# Altium schematic sheet 99_MISCS.SchDoc: Miscellaneous
size A; DocumentNumber: 12; SheetNumber: 12; SheetTotal: 12
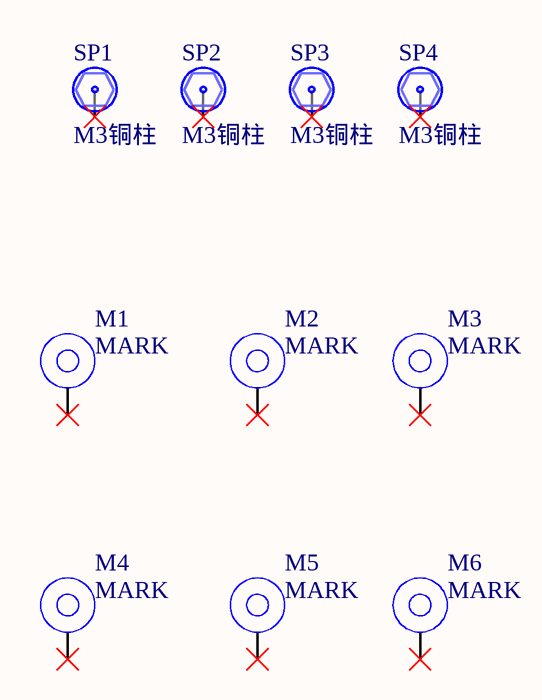
[diagram p0: 99_MISCS.SchDoc]

## Parts
M1  MARK  [MARK]  (net tie, no BOM)
M2  MARK  [MARK]  (net tie, no BOM)
M3  MARK  [MARK]  (net tie, no BOM)
M4  MARK  [MARK]  (net tie, no BOM)
M5  MARK  [MARK]  (net tie, no BOM)
M6  MARK  [MARK]  (net tie, no BOM)
SP1  M3铜柱  [M3x4_N]  (net tie, no BOM)
SP2  M3铜柱  [M3x4_N]  (net tie, no BOM)
SP3  M3铜柱  [M3x4_N]  (net tie, no BOM)
SP4  M3铜柱  [M3x4_N]  (net tie, no BOM)

## Nets

Not connected (* = marked no-connect by the designer): M1 1*; M2 1*; M3 1*; M4 1*; M5 1*; M6 1*; SP1 1*; SP2 1*; SP3 1*; SP4 1*

## Notes on the sheet
- Title
- Size:
- Date:
- A
- Number:
- Time:
- Revision:
- Sheet
- of
- Author: Edward Lai
- Email: edward@vibe.us
- Vibe Inc
- Hangzhou
- vibe.us <http://vibe.us>
- File:

## Library data of the parts
M1-M6 = MARK: PCBA MARKS
SP1-SP4 = 铜柱大焊盘: 铜柱